# EAGLE schematic proximity_sensor (EAGLE 7.1.0)
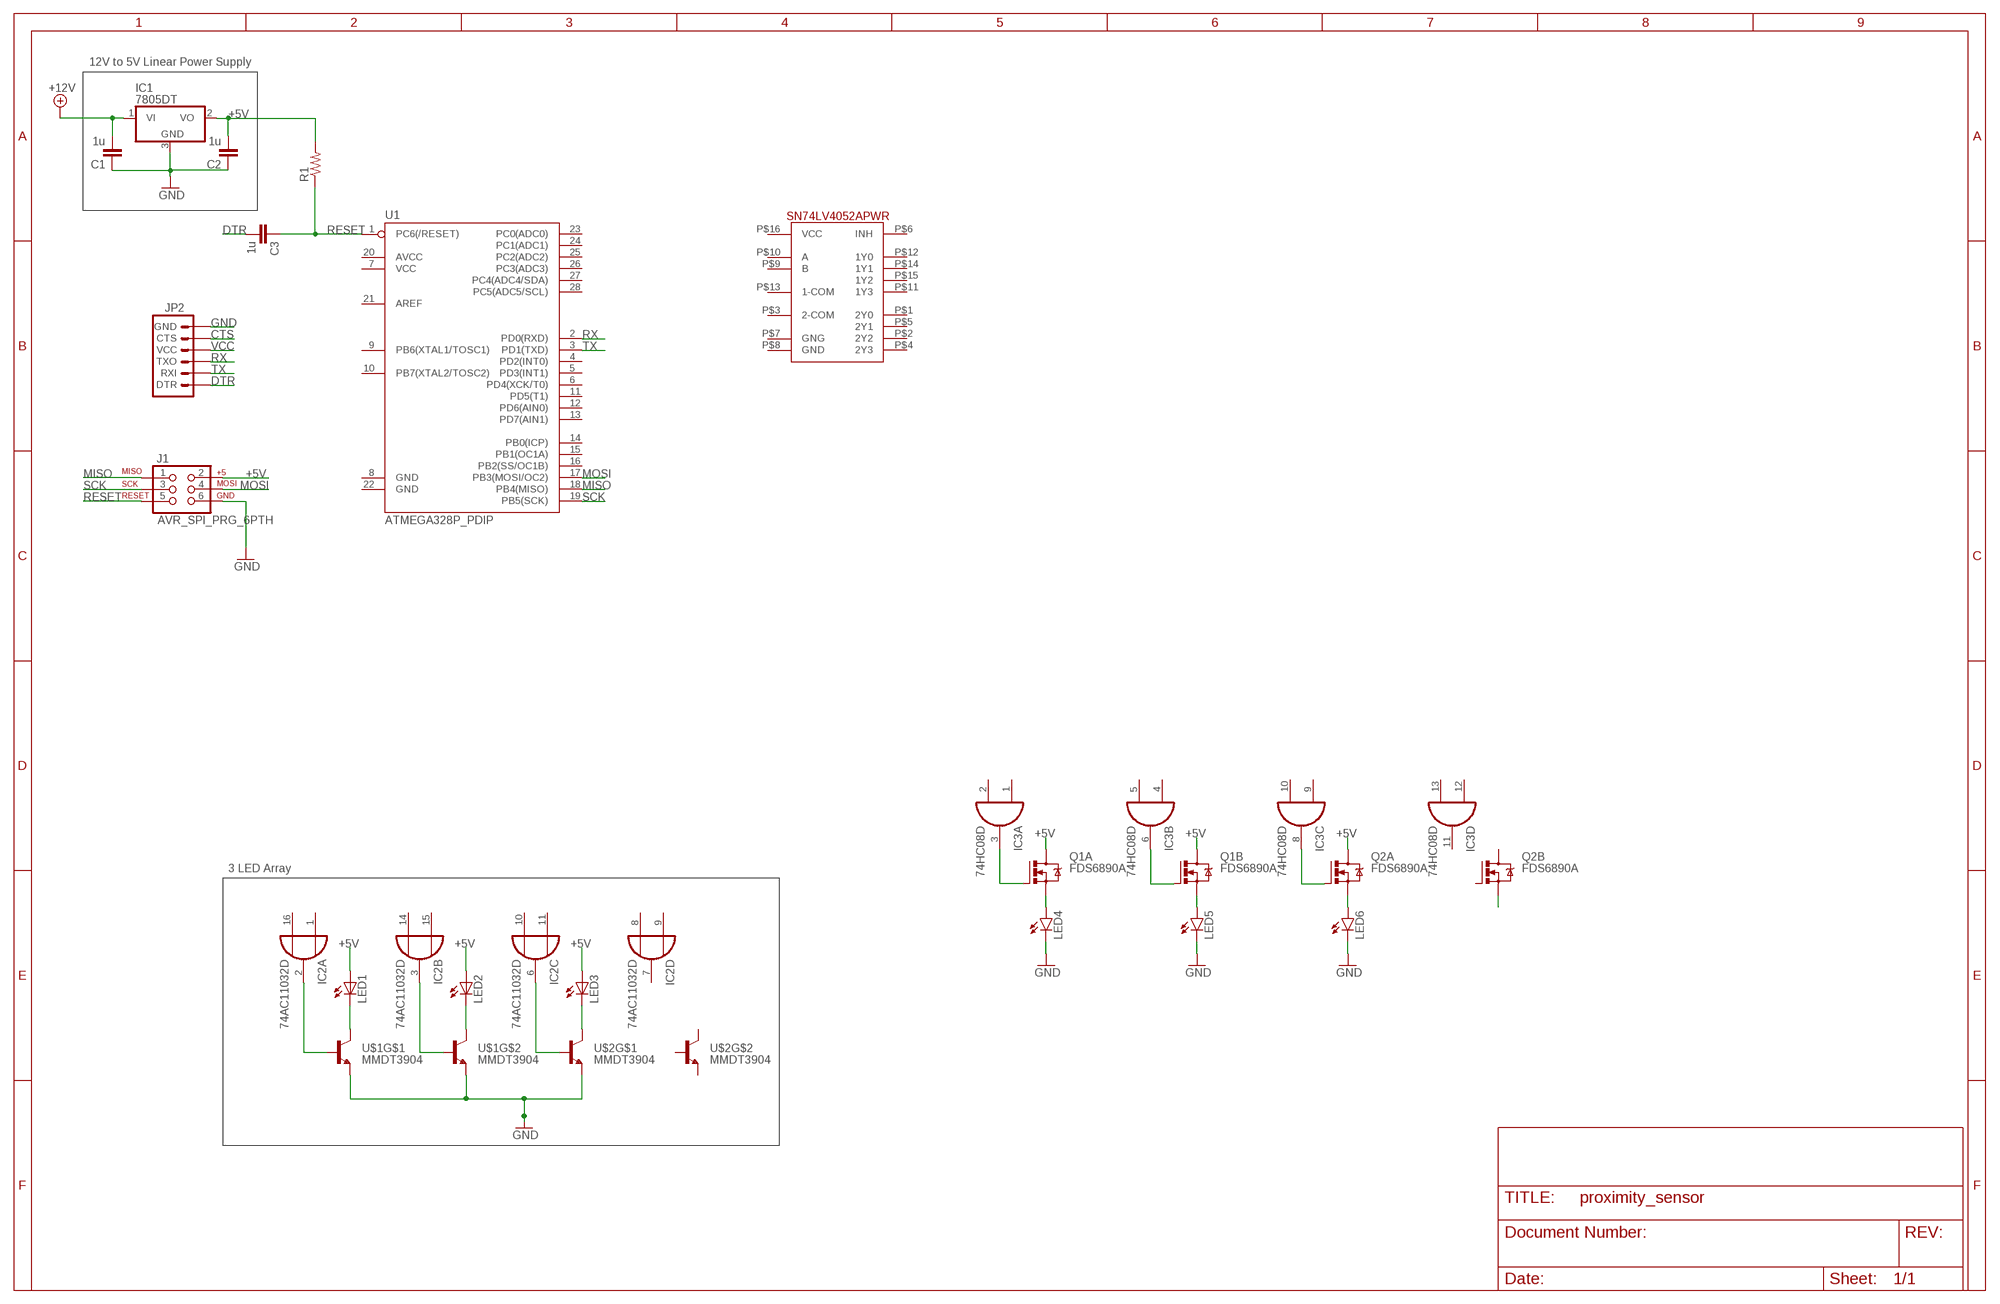
[diagram p0: schematic, sheet 1]

## Parts
C1  1u  C-EU025-024X044  [C025-024X044]
C2  1u  C-EU025-024X044  [C025-024X044]
C3  1u  C-EU025-024X044  [C025-024X044]
IC1  7805DT  [TO252]
IC2  74AC11032D  [SO16]
IC3  74HC08D  [SO14]
J1  AVR_SPI_PRG_6PTH  [2X3]
JP2  ARDUINO_SERIAL_PROGRAMPTH  [1X06]
LED1  LED3MM  [LED3MM]
LED2  LED3MM  [LED3MM]
LED3  LED3MM  [LED3MM]
LED4  LED-3MM-NO_SILK  [LED3MM-NS]
LED5  LED-3MM-NO_SILK  [LED3MM-NS]
LED6  LED-3MM-NO_SILK  [LED3MM-NS]
Q1  FDS6890A  [M08A]
Q2  FDS6890A  [M08A]
R1  R-US_0414/5V  [0414V]
U1  ATMEGA328P_PDIP  [DIL28-3]
U$1  MMDT3904  TRANSISTOR_NPN2UPMMDT3904  [SOT363]
U$2  MMDT3904  TRANSISTOR_NPN2UPMMDT3904  [SOT363]
U$3  SV74LV4052APWR2  [TVSOP-16]

## Nets
+5V: C2.2 IC1.2(VO) J1.2 LED1.A LED2.A LED3.A Q1.5(B:D) Q1.6(B:D) Q1.7(A:D) Q1.8(A:D) Q2.7(A:D) Q2.8(A:D) R1.2
+12V: C1.2 IC1.1(VI)
CTS: JP2.CTS
DTR: C3.2 JP2.DTR
GND: C1.1 C2.1 IC1.3(GND) J1.6 JP2.GND LED4.K(C) LED5.K(C) LED6.K(C) U$1.1(E) U$1.4(E) U$2.1(E)
MISO: J1.1 U1.18(PB4(MISO))
MOSI: J1.4 U1.17(PB3(MOSI/OC2))
N$1: IC2.2(A:O) U$1.2(B)
N$2: IC2.3(B:O) U$1.5(B)
N$3: IC2.6(C:O) U$2.2(B)
N$4: LED5.A Q1.3(B:S)
N$5: LED1.K(C) U$1.6(C)
N$6: LED4.A Q1.1(A:S)
N$7: LED6.A Q2.1(A:S)
N$8: LED2.K(C) U$1.3(C)
N$9: LED3.K(C) U$2.6(C)
N$10: Q2.3(B:S)
N$11: IC3.3(A:O) Q1.2(A:G)
N$12: IC3.6(B:O) Q1.4(B:G)
N$13: IC3.8(C:O) Q2.2(A:G)
RESET: C3.1 J1.5 R1.1 U1.1(PC6(/RESET))
RX: JP2.TXO U1.2(PD0(RXD))
SCK: J1.3 U1.19(PB5(SCK))
TX: JP2.RXI U1.3(PD1(TXD))
VCC: JP2.VCC
Unconnected: IC2.1(A:I1) IC2.7(D:O) IC2.8(D:I2) IC2.9(D:I1) IC2.10(C:I2) IC2.11(C:I1) IC2.14(B:I2) IC2.15(B:I1) IC2.16(A:I2) IC3.1(A:I0) IC3.2(A:I1) IC3.4(B:I0) IC3.5(B:I1) IC3.9(C:I0) IC3.10(C:I1) IC3.11(D:O) IC3.12(D:I0) IC3.13(D:I1) Q2.4(B:G) Q2.5(B:D) Q2.6(B:D) U1.4(PD2(INT0)) U1.5(PD3(INT1)) U1.6(PD4(XCK/T0)) U1.7(VCC) U1.8(GND) U1.9(PB6(XTAL1/TOSC1)) U1.10(PB7(XTAL2/TOSC2)) U1.11(PD5(T1)) U1.12(PD6(AIN0)) U1.13(PD7(AIN1)) U1.14(PB0(ICP)) U1.15(PB1(OC1A)) U1.16(PB2(SS/OC1B)) U1.20(AVCC) U1.21(AREF) U1.22(GND) U1.23(PC0(ADC0)) U1.24(PC1(ADC1)) U1.25(PC2(ADC2)) U1.26(PC3(ADC3)) U1.27(PC4(ADC4/SDA)) U1.28(PC5(ADC5/SCL)) U$2.3(C) U$2.4(E) U$2.5(B) U$3.P$1(2Y0) U$3.P$2(2Y2) U$3.P$3(2-COM) U$3.P$4(2Y3) U$3.P$5(2Y1) U$3.P$6(INH) U$3.P$7(GNG) U$3.P$8(GND) U$3.P$9(B) U$3.P$10(A) U$3.P$11(1Y3) U$3.P$12(1Y0) U$3.P$13(1-COM) U$3.P$14(1Y1) U$3.P$15(1Y2) U$3.P$16(VCC)

## Notes on the sheet
- 12V to 5V Linear Power Supply
- 3 LED Array

## Power pins joined to a net without a drawn wire
GND: IC2.4(P:GND) IC2.5(P:GND) IC3.7(P:GND)
VCC: IC2.12(P:VCC) IC2.13(P:VCC) IC3.14(P:VCC)

## Library data of the parts
C1-C3 = rcl:C-EU: CAPACITOR, European symbol
IC1 = linear:78*: Positive VOLTAGE REGULATOR Source: http://cache.national.com/ds/LM/LM78L05.pdf http://www.fairchildsemi.com/ds/LM/LM7805.pdf
IC2 = 74ac-logic:74AC11032: Quadruple 2-input OR
IC3 = 74xx-eu:74*08: Quad 2-input AND gate
J1 = SparkFun-Connectors:AVR_SPI_PRG_6: AVR ISP 6 Pin This is the reduced ISP connector for AVR programming. Common on Arduino. This footprint will take up less PCB space and can be used with a 10-pin to 6-pin adapter such as SKU: BOB-08508 **Special note about "TEST_POINT" package. The stop mask is on the top side, so if you want your programming test points to be on the bottom of your board, make sure to place this package on the bottom side of the board. This also ensure that the orientation to program from the bottom side will be correct.
JP2 = SparkFun-Connectors:ARDUINO_SERIAL_PROGRAM: FTDI connector footprints
LED1-LED3 = led:LED: LED OSRAM: - CHIPLED LG R971, LG N971, LY N971, LG Q971, LY Q971, LO R971, LY R971 LH N974, LH R974 LS Q976, LO Q976, LY Q976 LO Q996 - Hyper CHIPLED LW Q18S LB Q993, LB Q99A, LB R99A - SideLED LS A670, LO A670, LY A670, LG A670, LP A670 LB A673, LV A673, LT A673, LW A673 LH A674 LY A675 LS A676, LA A676, LO A676, LY A676, LW A676 LS A679, LY A679, LG A679 - Hyper Micro SIDELED® LS Y876, LA Y876, LO Y876, LY Y876 LT Y87S - SmartLED LW L88C, LW L88S LB L89C, LB L89S, LG L890 LS L89K, LO L89K, LY L89K LS L896, LA L896, LO L896, LY L896 - TOPLED LS T670, LO T670, LY T670, LG T670, LP T670 LSG T670, LSP T670, LSY T670, LOP T670, LYG T670 LG T671, LOG T671, LSG T671 LB T673, LV T673, LT T673, LW T673 LH T674 LS T676, LA T676, LO T676, LY T676, LB T676, LH T676, LSB T676, LW T676 LB T67C, LV T67C, LT T67C, LS T67K, LO T67K, LY T67K, LW E67C LS E67B, LA E67B, LO E67B, LY E67B, LB E67C, LV E67C, LT E67C LW T67C LS T679, LY T679, LG T679 LS T770, LO T770, LY T770, LG T770, LP T770 LB T773, LV T773, LT T773, LW T773 LH T774 LS E675, LA E675, LY E675, LS T675 LS T776, LA T776, LO T776, LY T776, LB T776 LHGB T686 LT T68C, LB T68C - Hyper Mini TOPLED® LB M676 - Mini TOPLED Santana® LG M470 LS M47K, LO M47K, LY M47K Source: http://www.osram.convergy.de LUXEON: - LUMILED® LXK2-PW12-R00, LXK2-PW12-S00, LXK2-PW14-U00, LXK2-PW14-V00 LXK2-PM12-R00, LXK2-PM12-S00, LXK2-PM14-U00 LXK2-PE12-Q00, LXK2-PE12-R00, LXK2-PE12-S00, LXK2-PE14-T00, LXK2-PE14-U00 LXK2-PB12-K00, LXK2-PB12-L00, LXK2-PB12-M00, LXK2-PB14-N00, LXK2-PB14-P00, LXK2-PB14-Q00 LXK2-PR12-L00, LXK2-PR12-M00, LXK2-PR14-Q00, LXK2-PR14-R00 LXK2-PD12-Q00, LXK2-PD12-R00, LXK2-PD12-S00 LXK2-PH12-R00, LXK2-PH12-S00 LXK2-PL12-P00, LXK2-PL12-Q00, LXK2-PL12-R00 Source: www.luxeon.com KINGBRIGHT: KA-3528ASYC Source: www.kingbright.com
LED4-LED6 = SparkFun-LED:LED: LEDs Standard schematic elements and footprints for 5mm, 3mm, 1206, and 0603 sized LEDs. 5mm - Spark Fun Electronics SKU : COM-00529 (and others)
Q1 Q2 = transistor-power:FDS6890A: Dual N-Channel 2.5V Specified PowerTrenchTM MOSFET Source: FDS6890A.pdf
R1 = rcl:R-US_: RESISTOR, American symbol
U1 = SparkFun-DigitalIC:ATMEGA328P_PDIP: uC used in the Arduino 32kb flash, 1k EEPROM, 2k SRAM This is the through-hole version of this chip.
U$1 U$2 = SparkFun-DiscreteSemi:TRANSISTOR_NPN2UP: 2-up package of NPN transistors MMDT3904- TRANS-09373 (SOT-363, 200mA 40V); PROD_ID: TRANS-09373
U$3 = SparkFun-AnalogIC:SV74LV4052APWR: Dual 4:1 analog mux